# Altium schematic sheet Slave.SchDoc: Slave_subcircuit
size A4; DrawnBy: A.F
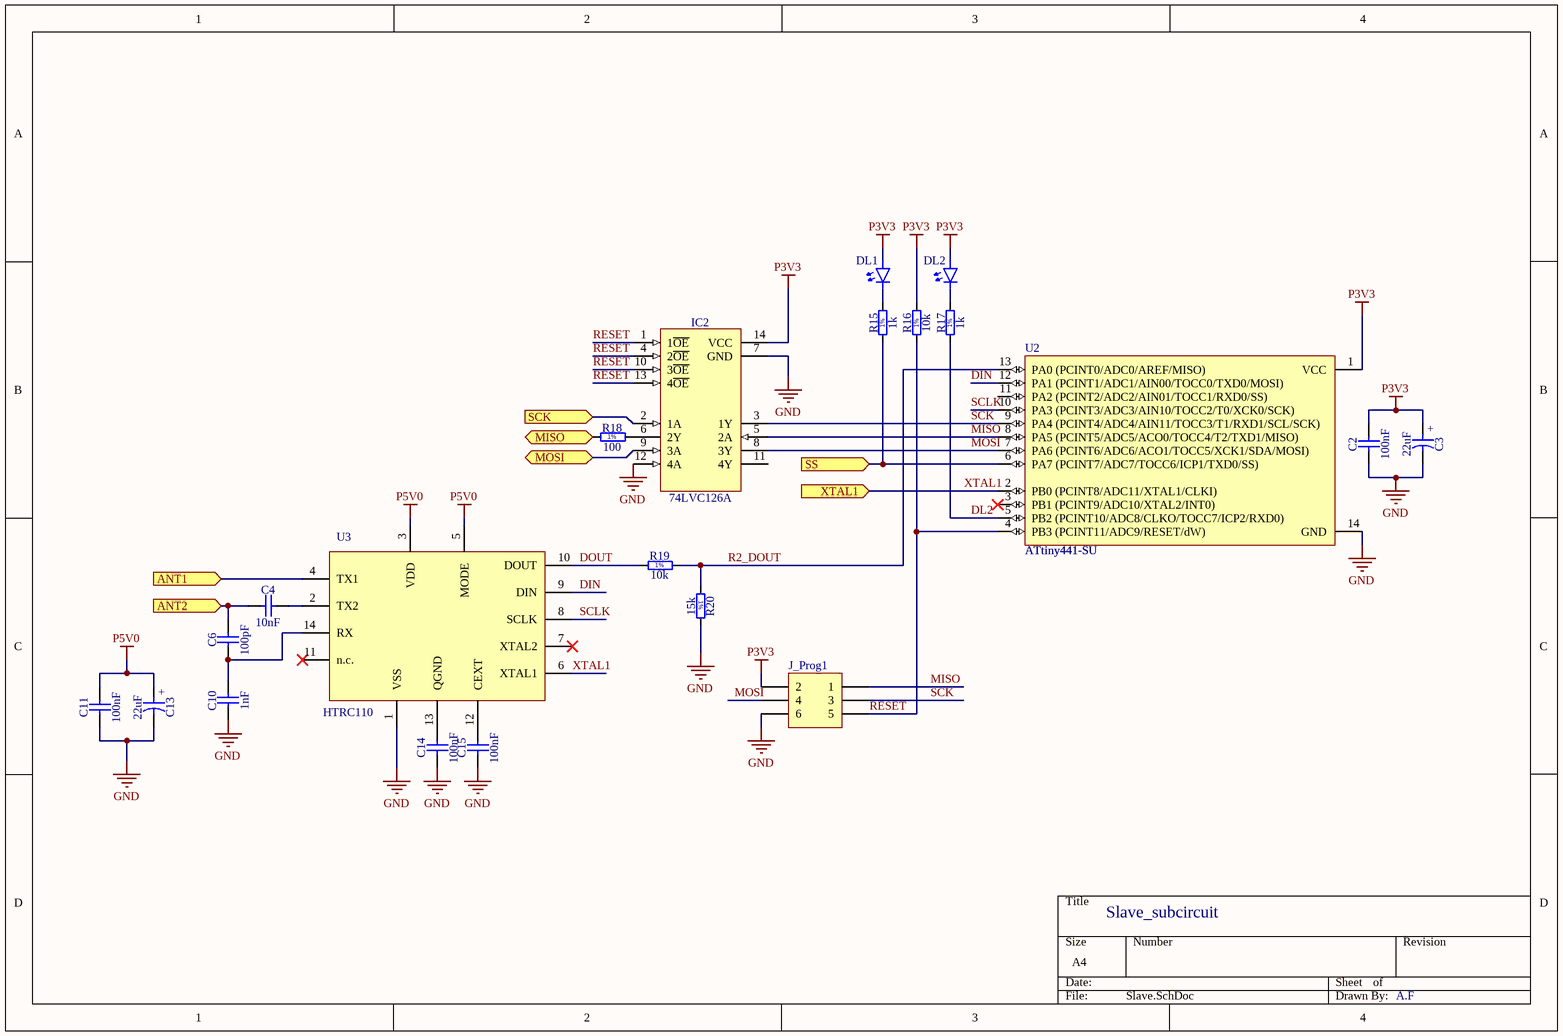
[diagram p0: Slave.SchDoc]

## Parts
C2  100nF  [CAPC1608X87N]
C3  22uF  [CAPAE430X540N]
C4  10nF  [CAPC1608X87N]
C6  100pF  [CAPC1608X90N]
C10  1nF  [CAPC1608X87N]
C11  100nF  [CAPC1608X87N]
C13  22uF  [CAPAE430X540N]
C14  100nF  [CAPC1608X87N]
C15  100nF  [CAPC1608X87N]
DL1  (no value)  [0805_LED]
DL2  (no value)  [0805_LED]
IC2  74LVC126A  [SOIC127P600X175-14N]
J_Prog1  (no value)  [HDR2X3]
R15  1k  [RESC1608X50N]
R16  10k  [RESC1608X50N]
R17  1k  [RESC1608X50N]
R18  100  [RESC1608X50N]
R19  10k  [RESC1608X50N]
R20  15k  [RESC1608X50N]
U2  ATtiny441-SU  [14S1_L]
U3  HTRC110  [SOIC127P600X175-14N]

## Ports
ANT1 (in), ANT2 (in), MISO (out), MOSI (bidir), SCK (in), SS (in), XTAL1 (in)

## Nets
GND: C2.1 C3.2 C10.1 C11.1 C13.2 C14.1 C15.1 IC2.7(GND) IC2.12(4A) J_Prog1.6 R20.2 U2.14(GND) U3.1(VSS)
P3V3: C2.2 C3.1 DL1.A DL2.A IC2.14(VCC) J_Prog1.2 R16.2 U2.1(VCC)
P5V0: C11.2 C13.1 U3.3(VDD) U3.5(MODE)
ANT1: U3.4(TX1) ; port ANT1
ANT2: C4.1 C6.2 ; port ANT2
DIN: U2.12(PA1_(PCINT1/ADC1/AIN00/TOCC0/TXD0/MOSI)) U3.9(DIN)
DL2: R17.1 U2.5(PB2_(PCINT10/ADC8/CLKO/TOCC7/ICP2/RXD0))
DOUT: R19.1 U3.10(DOUT)
MISO: IC2.5(2A) J_Prog1.1 U2.8(PA5_(PCINT5/ADC5/ACO0/TOCC4/T2/TXD1/MISO))
MISO: R18.1 ; port MISO  [a separate net that carries the same name]
MOSI: IC2.8(3Y) J_Prog1.4 U2.7(PA6_(PCINT6/ADC6/ACO1/TOCC5/XCK1/SDA/MOSI))
MOSI: IC2.9(3A) ; port MOSI  [a separate net that carries the same name]
R2_DOUT: R19.2 R20.1 U2.13(PA0_(PCINT0/ADC0/AREF/MISO))
RESET: IC2.1(1~{OE}) IC2.4(2~{OE}) IC2.10(3~{OE}) IC2.13(4~{OE}) J_Prog1.5 R16.1 U2.4(PB3_(PCINT11/ADC9/RESET/dW))
SCK: IC2.3(1Y) J_Prog1.3 U2.9(PA4_(PCINT4/ADC4/AIN11/TOCC3/T1/RXD1/SCL/SCK))
SCK: IC2.2(1A) ; port SCK  [a separate net that carries the same name]
SCLK: U2.10(PA3_(PCINT3/ADC3/AIN10/TOCC2/T0/XCK0/SCK)) U3.8(SCLK)
SS: R15.1 U2.6(PA7_(PCINT7/ADC7/TOCC6/ICP1/TXD0/SS)) ; port SS
XTAL1: U2.2(PB0_(PCINT8/ADC11/XTAL1/CLKI)) U3.6(XTAL1) ; port XTAL1
NetC4_2: C4.2 U3.2(TX2)
NetC6_1: C6.1 C10.2 U3.14(RX)
NetC14_2: C14.2 U3.13(QGND)
NetC15_2: C15.2 U3.12(CEXT)
NetDL1_K: DL1.K R15.2
NetDL2_K: DL2.K R17.2
NetIC2_6: IC2.6(2Y) R18.2

Not connected (* = marked no-connect by the designer): IC2 11(4Y); U2 3(PB1_(PCINT9/ADC10/XTAL2/INT0))* 11(PA2_(PCINT2/ADC2/AIN01/TOCC1/RXD0/SS)); U3 7(XTAL2)* 11(n.c.)*

## Notes on the sheet
- (in symbol CAE430-540_22UF_10V_20%) +
- (in symbol R0603_10K_1%_0.1W_100PPM) 1%
- (in symbol R0603_15K_1%_0.1W_100PPM) 1%
- (in symbol R0603_100R_1%_0.1W_100PPM) 1%
- (in symbol R0805_1K_1%_0.33W_100PPM_VISHAY_CRCW-HP) 1%

## Library data of the parts
C2 C14 C15 = CC0603_100NF_50V_10%_X5R: Non-polarised capacitor; Part Description: SMD Multilayer Chip Ceramic Capacitor; Manufacturer: GENERIC; Manufacturer1 Part Number: C1608X5R1H104K080AA; Voltage: 50V; TC: X5R; Tolerance: ±10%; Part Number: CC0603_100NF_50V_10%_X5R; Component Kind: Standard; Component Type: Standard; Pin Count: 2; Value: 100nF; Status: None; Manufacturer Part Number: CC0603_100NF_50V_10%_X5R; Case: 0603; Mounted: Yes; Socket: No; SMD: Yes; Sense: No; Manufacturer1 Example: TDK; Manufacturer1 ComponentHeight: 0.9mm; HelpURL: \\cern.ch\dfs\Applications\Altium\Datasheets\CC0603_X5R_TDK_C.pdf; Author: CERN DEM MR; CreateDate: 08.01.2016; LatestRevisionDate: 08.01.2016
C3 C13 = CAE430-540_22UF_10V_20%: Polarised capacitor; Part Description: Aluminum Electrolytic SMT Capacitor; Manufacturer: PANASONIC; Manufacturer Part Number: EEEFK1A220AR; Voltage: 10V; Tolerance: ±20%; Part Number: CAE430-540_22UF_10V_20%; Component Kind: Standard; Component Type: Standard; Pin Count: 2; Value: 22uF; Status: Not Recommended; Case: B; Mounted: Yes; Socket: No; SMD: Yes; Sense: No; ComponentHeight: 5.8mm; HelpURL: \\cern.ch\dfs\Applications\Altium\Datasheets\CAE_PANASONIC_FK.pdf; Author: CERN DEM JLC; CreateDate: 2007-12-03; LatestRevisionDate: 2014-11-05
C4 = CC0603_10NF_50V_10%_X7R: Non-polarised capacitor; Part Description: SMD Multilayer Chip Ceramic Capacitor; Manufacturer: GENERIC; Manufacturer1 Part Number: 223858615636; Voltage: 50V; TC: X7R; Tolerance: ±10%; Part Number: CC0603_10NF_50V_10%_X7R; Component Kind: Standard; Component Type: Standard; Pin Count: 2; Value: 10nF; Status: Preferred; Manufacturer Part Number: CC0603_10NF_50V_10%_X7R; Case: 0603; Mounted: Yes; Socket: No; SMD: Yes; Sense: No; Manufacturer1 Example: PHYCOMP; Manufacturer1 ComponentHeight: 0.87mm; HelpURL: \\cern.ch\dfs\Applications\Altium\Datasheets\CC0603_X7R_PHYCOMP.pdf; Author: CERN DEM JLC; CreateDate: 2007-12-03; LatestRevisionDate: 2007-12-03
C6 = CC0603_100PF_250V_5%_ATC_600S: Non-polarised capacitor; Part Description: Ultra-Low ESR, High Q, NPO RF & Microwave Capacitor; Manufacturer: AMERICAN TECHNICAL CERAMICS (ATC); Manufacturer Part Number: 600S101JT250XT; Voltage: 250V; TC: C0G/NP0; Tolerance: ±5%; Part Number: CC0603_100PF_250V_5%_ATC_600S; Component Kind: Standard; Component Type: Standard; Pin Count: 2; Value: 100pF; Status: Not Recommended; Case: 0603; Mounted: Yes; Socket: No; SMD: Yes; Sense: No; ComponentHeight: 0.89mm; HelpURL: \\cern.ch\dfs\Applications\Altium\Datasheets\CC0603_ATC_600S.pdf; Author: CERN DEM JMW; CreateDate: 2016-08-11; LatestRevisionDate: 2016-08-11
C10 C11 = CC0603_10NF_50V_10%_X7R: Non-polarised capacitor; Part Description: SMD Multilayer Chip Ceramic Capacitor; Manufacturer: GENERIC; Manufacturer1 Part Number: 223858615636; Value: 10nF; Voltage: 50V; TC: X7R; Tolerance: ±10%; Part Number: CC0603_10NF_50V_10%_X7R; Component Kind: Standard; Component Type: Standard; Pin Count: 2; Status: Preferred; Manufacturer Part Number: CC0603_10NF_50V_10%_X7R; Case: 0603; Mounted: Yes; Socket: No; SMD: Yes; Sense: No; Manufacturer1 Example: PHYCOMP; Manufacturer1 ComponentHeight: 0.87mm; HelpURL: \\cern.ch\dfs\Applications\Altium\Datasheets\CC0603_X7R_PHYCOMP.pdf; Author: CERN DEM JLC; CreateDate: 2007-12-03; LatestRevisionDate: 2007-12-03
DL1 DL2 = LED1: Light Emitting Diode
IC2 = 74125: Quadruple Bus Buffer with 3-State Outputs; Manufacturer: TEXAS INSTRUMENTS; PressFit: No; Bonding: No; Part Number: 74LVC126A; Component Kind: Standard; Component Type: Standard; Device: 74LVC126A; PackageDescription: SOIC 14, Pitch 1.27mm - Body 4x8.75mm, IPC Medium Density; Part Description: Quadruple Bus Buffer with 3-State Outputs; Manufacturer Part Number: 74LVC126A; Pin Count: 14; Case: SOIC14; Mounted: Yes; Socket: No; SMD: Yes; Sense: No; ComponentHeight: 1.75mm; Author: CERN DEM JLC; HelpURL: \\cern.ch\dfs\Applications\Altium\Datasheets\SN74HC125D.pdf; CreateDate: 2011-06-30; LatestRevisionDate: 2011-06-30
J_Prog1 = Header 3X2: Header, 3-Pin, Dual row; LatestRevisionDate: 17-Jul-2002; LatestRevisionNote: Re-released for DXP Platform.; Publisher: Altium Limited
R15 R17 = R0805_1K_1%_0.33W_100PPM_VISHAY_CRCW-HP: Resistor - 1%; Part Description: 150V, Pulse Proof, High Power Thick Film Chip Resistor; Manufacturer: VISHAY DRALORIC; Manufacturer Part Number: CRCW08051K00FKEAHP; Power: 0.33W; TC: ±100ppm/°C; PressFit: No; Part Number: R0805_1K_1%_0.33W_100PPM_VISHAY_CRCW-HP; Component Kind: Standard; Component Type: Standard; Footprint: RESC2012X60N; Pin Count: 2; Value: 1k; Status: None; Tolerance: ±1%; Case: 0805; Mounted: Yes; Sense: No; Socket: No; SMD: Yes; Manufacturer1 ComponentHeight: 0.6mm; HelpURL: \\cern.ch\dfs\Applications\Altium\Datasheets\R0805_VISHAY_CRCW-HP e3.pdf; Author: CERN DEM JLC; CreateDate: 2010-06-16; LatestRevisionDate: 2010-06-16
R16 = R0805_1K_1%_0.33W_100PPM_VISHAY_CRCW-HP: Resistor - 1%; Part Description: 150V, Pulse Proof, High Power Thick Film Chip Resistor; Manufacturer: VISHAY DRALORIC; Manufacturer Part Number: CRCW08051K00FKEAHP; Value: 1k; Power: 0.33W; TC: ±100ppm/°C; PressFit: No; Part Number: R0805_1K_1%_0.33W_100PPM_VISHAY_CRCW-HP; Component Kind: Standard; Component Type: Standard; Footprint: RESC2012X60N; Pin Count: 2; Status: None; Tolerance: ±1%; Case: 0805; Mounted: Yes; Sense: No; Socket: No; SMD: Yes; Manufacturer1 ComponentHeight: 0.6mm; HelpURL: \\cern.ch\dfs\Applications\Altium\Datasheets\R0805_VISHAY_CRCW-HP e3.pdf; Author: CERN DEM JLC; CreateDate: 2010-06-16; LatestRevisionDate: 2010-06-16
R18 = R0603_100R_1%_0.1W_100PPM: Resistor - 1%; Part Description: General Purpose Thick Film Chip Resistor; Manufacturer: GENERIC; Manufacturer1 Part Number: NRC06F4700TRF; Power: 0.1W; TC: ±100ppm/°C; PressFit: No; Part Number: R0603_100R_1%_0.1W_100PPM; Component Kind: Standard; Component Type: Standard; Footprint: RESC1608X55N; Pin Count: 2; Value: 100; Status: Preferred; Tolerance: ±1%; Manufacturer Part Number: R0603_100R_1%_0.1W_100PPM; Case: 0603; Mounted: Yes; Sense: No; Socket: No; SMD: Yes; Manufacturer1 Example: NIC COMPONENT; Manufacturer1 ComponentHeight: 0.55mm; HelpURL: \\cern.ch\dfs\Applications\Altium\Datasheets\R0603_NIC_NRC.pdf; Author: CERN DEM JLC; CreateDate: 2007-12-03; LatestRevisionDate: 2008-03-13
R19 = R0603_10K_1%_0.1W_100PPM: Resistor - 1%; Part Description: General Purpose Thick Film Chip Resistor; Manufacturer: GENERIC; Manufacturer1 Part Number: NRC06F1002TRF; Power: 0.1W; TC: ±100ppm/°C; PressFit: No; Part Number: R0603_10K_1%_0.1W_100PPM; Component Kind: Standard; Component Type: Standard; Footprint: RESC1608X55N; Pin Count: 2; Value: 10k; Status: Preferred; Tolerance: ±1%; Manufacturer Part Number: R0603_10K_1%_0.1W_100PPM; Case: 0603; Mounted: Yes; Sense: No; Socket: No; SMD: Yes; Manufacturer1 Example: NIC COMPONENT; Manufacturer1 ComponentHeight: 0.55mm; HelpURL: \\cern.ch\dfs\Applications\Altium\Datasheets\R0603_NIC_NRC.pdf; Author: CERN DEM JLC; CreateDate: 2007-12-03; LatestRevisionDate: 2008-03-13
R20 = R0603_15K_1%_0.1W_100PPM: Resistor - 1%; Part Description: General Purpose Thick Film Chip Resistor; Manufacturer: GENERIC; Manufacturer1 Part Number: NRC06F1502TRF; Power: 0.1W; TC: ±100ppm/°C; PressFit: No; Part Number: R0603_15K_1%_0.1W_100PPM; Component Kind: Standard; Component Type: Standard; Footprint: RESC1608X55N; Pin Count: 2; Value: 15k; Status: Preferred; Tolerance: ±1%; Manufacturer Part Number: R0603_15K_1%_0.1W_100PPM; Case: 0603; Mounted: Yes; Sense: No; Socket: No; SMD: Yes; Manufacturer1 Example: NIC COMPONENT; Manufacturer1 ComponentHeight: 0.55mm; HelpURL: \\cern.ch\dfs\Applications\Altium\Datasheets\R0603_NIC_NRC.pdf; Author: CERN DEM JMW; CreateDate: 2015-08-17; LatestRevisionDate: 2015-08-17
U2 = ATtiny441-SU: 8-bit AVR Microcontroller, 1.8-5.5V, 2KB Flash, 128 Bytes SRAM, 12 GPIO pins, 14-pin SOIC, Industrial Grade (-40°C to 85°C), Pb-Free; Published: 1-Apr-2010; DatasheetVersion: revA, Mar-2010; PackageVersion: revA, Feb-2002; PackageReference: 14S1; Publisher: Altium Limited; PackageDescription: 14-Lead, 0.150” Wide Body, Plastic Gull Wing Small Outline Package (SOIC); Code_JEDEC: MS-012-AB; Code_IPC: SOIC127P600-14; ComponentLink1Description: ATtiny20 Datasheet; ComponentLink1URL: http://www.atmel.com/dyn/resources/prod_documents/doc8235.pdf; ComponentLink2Description: ATtiny20 Summary; ComponentLink2URL: http://www.atmel.com/dyn/resources/prod_documents/8235S.pdf; ComponentLink3Description: Atmel.com Home; ComponentLink3URL: http://www.atmel.com; Supplier 1: Digi-Key; Supplier Part Number 1: 1611-ATTINY44-15SSZCT-ND; Name: ATtiny441-SU
U3 = HTRC110: HITAG reader chip